# EAGLE design Smoothie Stamp Carrier A3 (EAGLE 6.4)

## Sheet 1 of 4: Brain Breakout
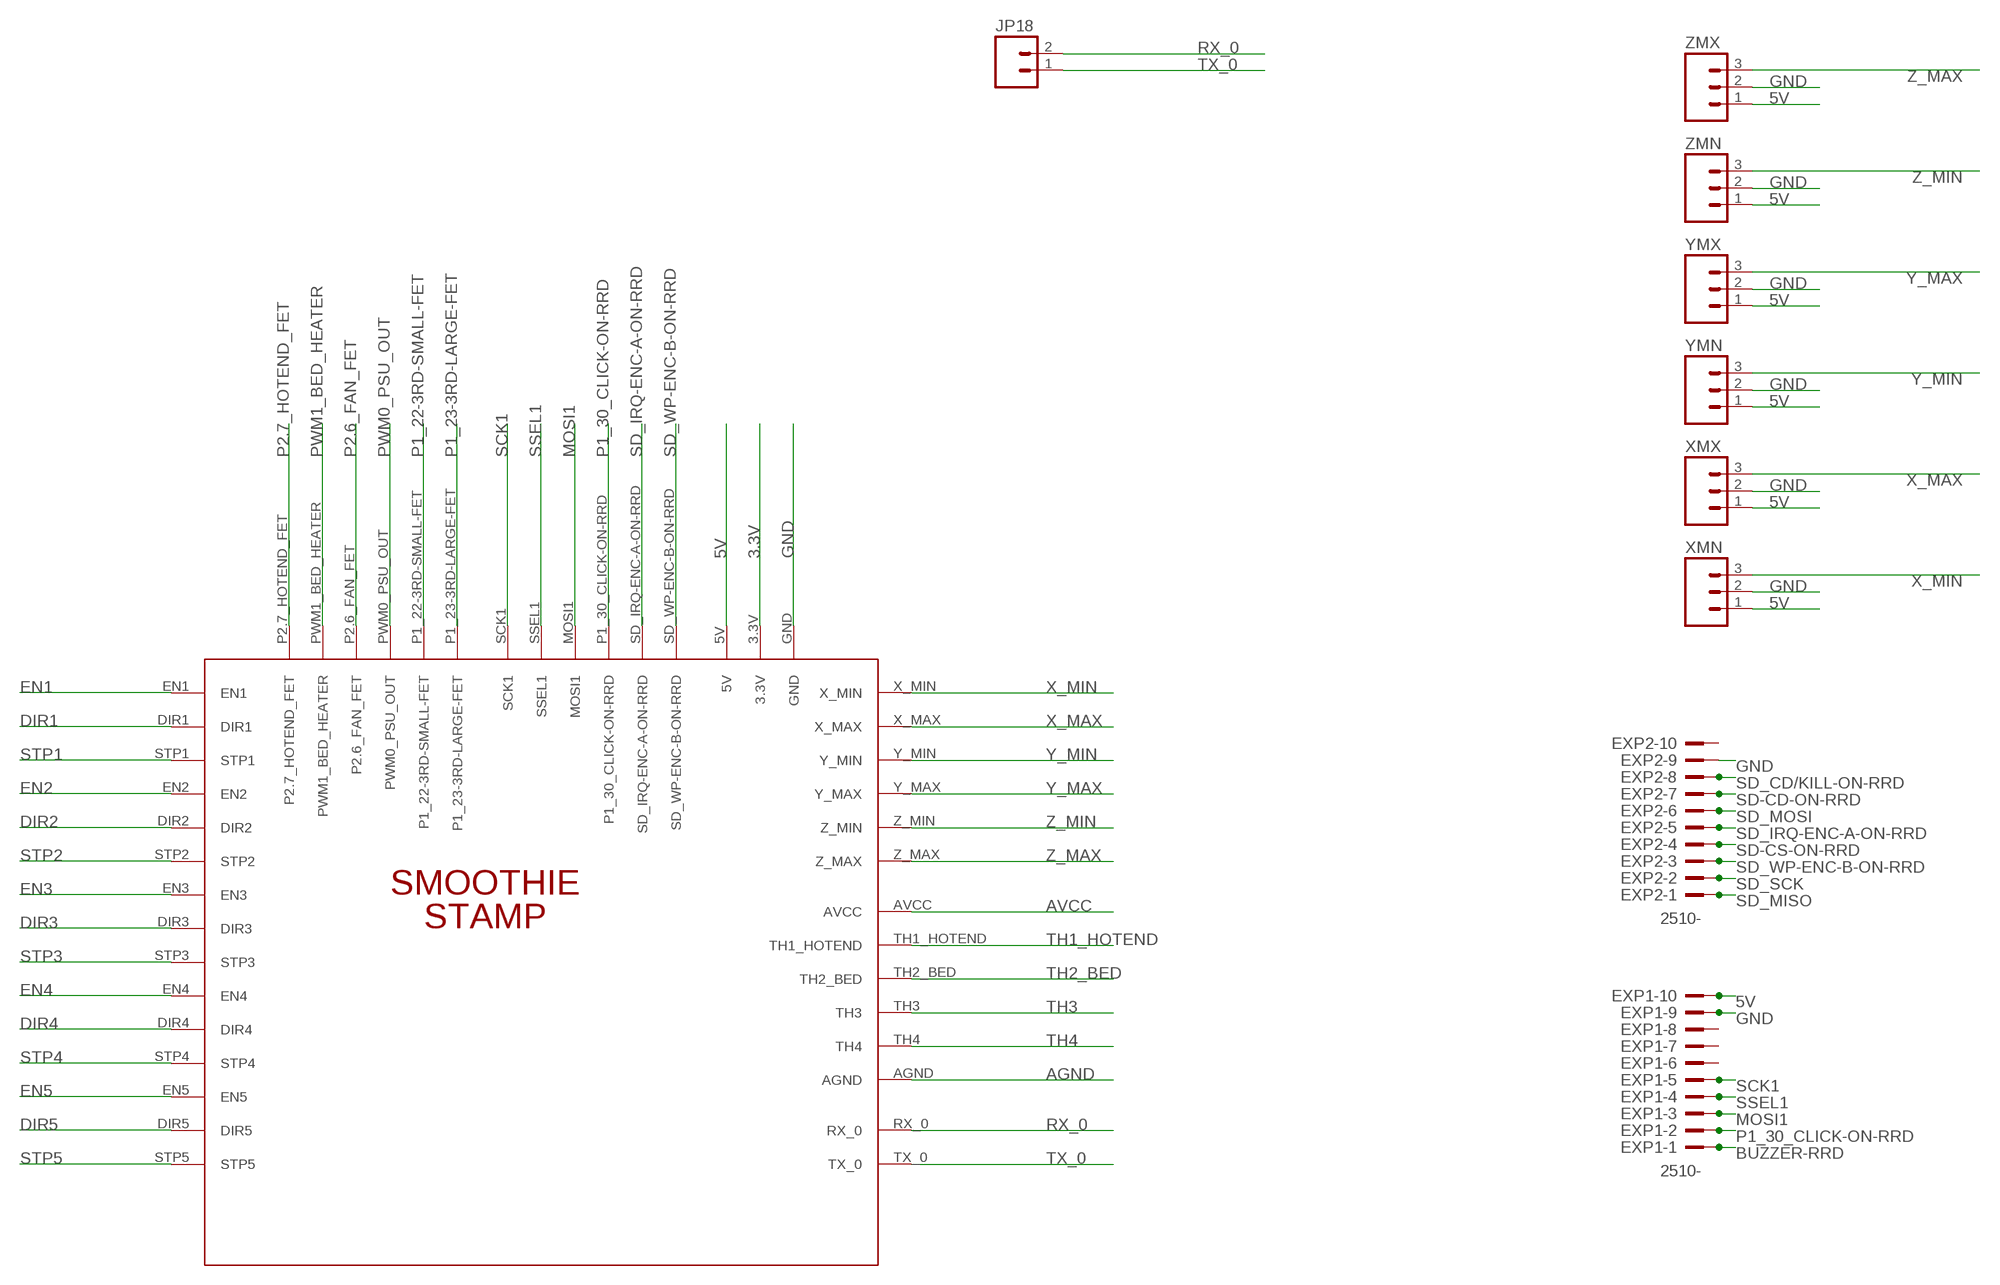
[diagram p0: schematic, sheet 1]

### Parts
EXP1  2510-  [PAK100/2500-10]
EXP2  2510-  [PAK100/2500-10]
JP18  M02LOCK  [1X02_LOCK]
U$1  SMOOTHIE-STAMPSMOOTHIE-STAMP-PTH  [SMOOTHIE-STAMP-PTH]
XMN  M03LOCK  [1X03_LOCK]
XMX  M03LOCK  [1X03_LOCK]
YMN  M03LOCK  [1X03_LOCK]
YMX  M03LOCK  [1X03_LOCK]
ZMN  M03LOCK  [1X03_LOCK]
ZMX  M03LOCK  [1X03_LOCK]

### Nets
3.3V: U$1.3.3V ; also sheet 2
5V: EXP1.10 U$1.5V XMN.1 XMX.1 YMN.1 YMX.1 ZMN.1 ZMX.1 ; also sheet 3
AGND: U$1.AGND ; also sheet 3
AVCC: U$1.AVCC ; also sheet 3
BUZZER-RRD: EXP1.1
DIR1 [Larger-Signals]: U$1.DIR1 ; also sheet 2
DIR2 [Larger-Signals]: U$1.DIR2 ; also sheet 2
DIR3 [Larger-Signals]: U$1.DIR3 ; also sheet 2
DIR4 [Larger-Signals]: U$1.DIR4 ; also sheet 2
DIR5 [Larger-Signals]: U$1.DIR5 ; also sheet 2
EN1 [Larger-Signals]: U$1.EN1 ; also sheet 2
EN2 [Larger-Signals]: U$1.EN2 ; also sheet 2
EN3 [Larger-Signals]: U$1.EN3 ; also sheet 2
EN4 [Larger-Signals]: U$1.EN4 ; also sheet 2
EN5 [Larger-Signals]: U$1.EN5 ; also sheet 2
GND: EXP1.9 EXP2.9 U$1.GND XMN.2 XMX.2 YMN.2 YMX.2 ZMN.2 ZMX.2 ; also sheet 2,3,4
MOSI1: EXP1.3 U$1.MOSI1
P1_22-3RD-SMALL-FET [Larger-Signals]: U$1.P1_22-3RD-SMALL-FET ; also sheet 3
P1_23-3RD-LARGE-FET [Larger-Signals]: U$1.P1_23-3RD-LARGE-FET ; also sheet 3
P1_30_CLICK-ON-RRD: EXP1.2 U$1.P1_30_CLICK-ON-RRD
P2.6_FAN_FET [Larger-Signals]: U$1.P2.6_FAN_FET ; also sheet 3
P2.7_HOTEND_FET [Larger-Signals]: U$1.P2.7_HOTEND_FET ; also sheet 3
PWM0_PSU_OUT [Larger-Signals]: U$1.PWM0_PSU_OUT ; also sheet 3
PWM1_BED_HEATER [Larger-Signals]: U$1.PWM1_BED_HEATER ; also sheet 3
RX_0: JP18.2 U$1.RX_0
SCK1: EXP1.5 U$1.SCK1
SD-CD-ON-RRD: EXP2.7
SD-CS-ON-RRD: EXP2.4
SD_CD/KILL-ON-RRD: EXP2.8
SD_IRQ-ENC-A-ON-RRD: EXP2.5 U$1.SD_IRQ-ENC-A-ON-RRD
SD_MISO: EXP2.1
SD_MOSI: EXP2.6
SD_SCK: EXP2.2
SD_WP-ENC-B-ON-RRD: EXP2.3 U$1.SD_WP-ENC-B-ON-RRD
SSEL1: EXP1.4 U$1.SSEL1
STP1 [Larger-Signals]: U$1.STP1 ; also sheet 2
STP2 [Larger-Signals]: U$1.STP2 ; also sheet 2
STP3 [Larger-Signals]: U$1.STP3 ; also sheet 2
STP4 [Larger-Signals]: U$1.STP4 ; also sheet 2
STP5 [Larger-Signals]: U$1.STP5 ; also sheet 2
TH1_HOTEND: U$1.TH1_HOTEND ; also sheet 3
TH2_BED: U$1.TH2_BED ; also sheet 3
TH3: U$1.TH3 ; also sheet 3
TH4: U$1.TH4 ; also sheet 3
TX_0: JP18.1 U$1.TX_0
X_MAX: U$1.X_MAX XMX.3
X_MIN: U$1.X_MIN XMN.3
Y_MAX: U$1.Y_MAX YMX.3
Y_MIN: U$1.Y_MIN YMN.3
Z_MAX: U$1.Z_MAX ZMX.3
Z_MIN: U$1.Z_MIN ZMN.3
Unconnected: EXP1.6 EXP1.7 EXP1.8 EXP2.10

## Sheet 2 of 4: Stepper Drivers
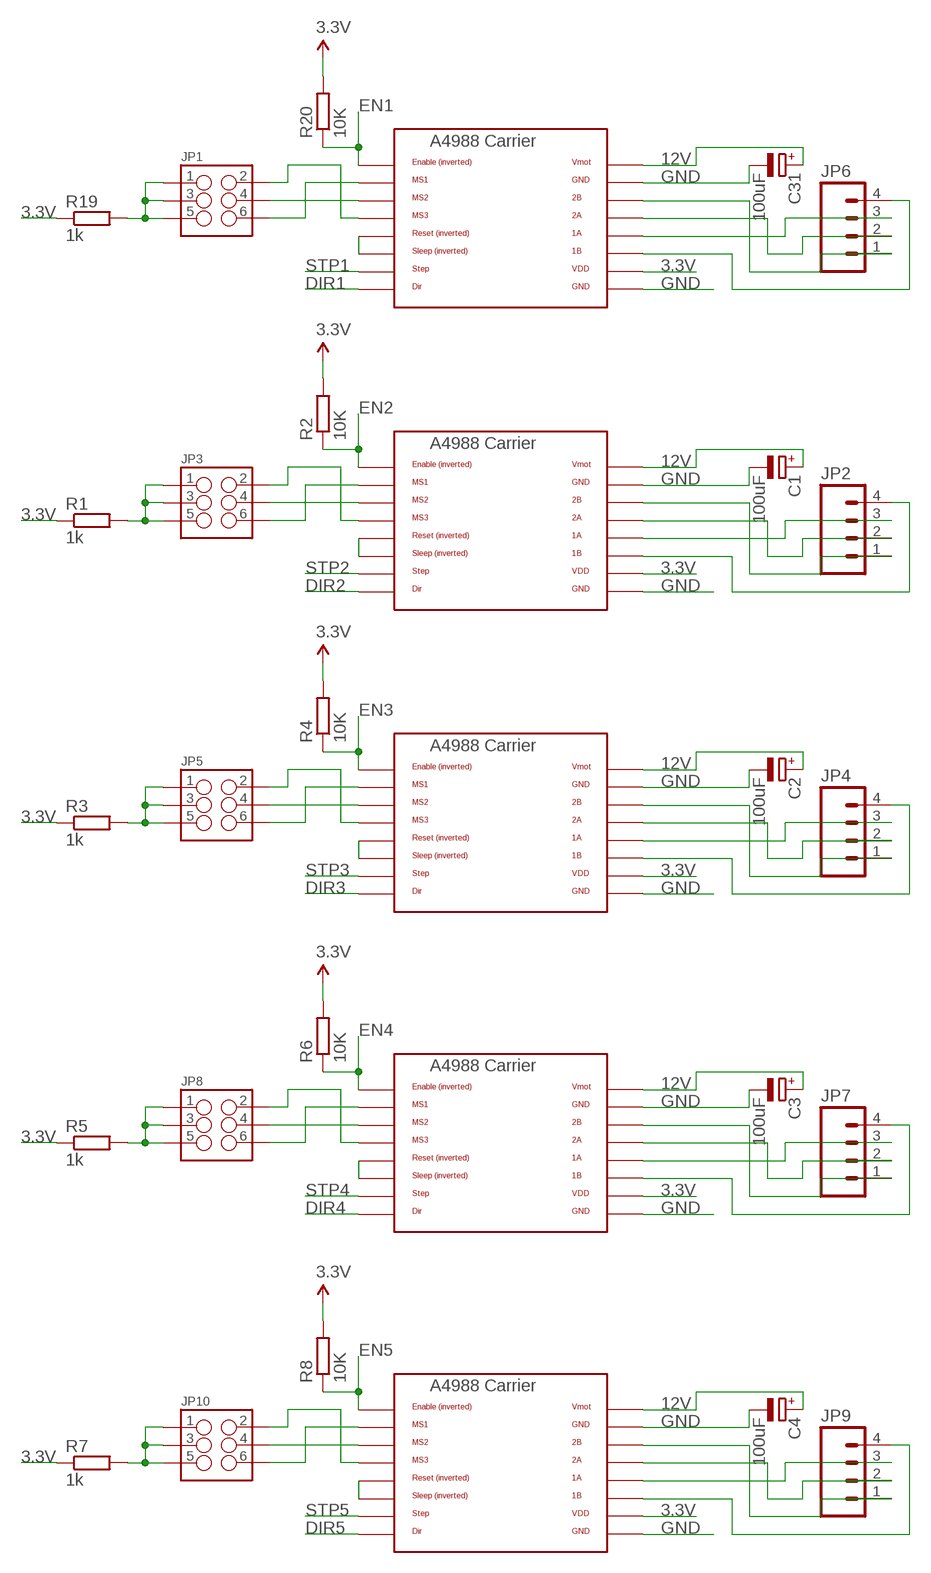
[diagram p1: schematic, sheet 2]

### Parts
C1  100uF  CPOL-EUE3.5-8  [E3,5-8]
C2  100uF  CPOL-EUE3.5-8  [E3,5-8]
C3  100uF  CPOL-EUE3.5-8  [E3,5-8]
C4  100uF  CPOL-EUE3.5-8  [E3,5-8]
C31  100uF  CPOL-EUE3.5-8  [E3,5-8]
JP1  M03X22X3_SILK_MALE_PTH  [2X3]
JP2  M04POLAR_LOCK  [MOLEX-1X4_LOCK]
JP3  M03X22X3_SILK_MALE_PTH  [2X3]
JP4  M04POLAR_LOCK  [MOLEX-1X4_LOCK]
JP5  M03X22X3_SILK_MALE_PTH  [2X3]
JP6  M04POLAR_LOCK  [MOLEX-1X4_LOCK]
JP7  M04POLAR_LOCK  [MOLEX-1X4_LOCK]
JP8  M03X22X3_SILK_MALE_PTH  [2X3]
JP9  M04POLAR_LOCK  [MOLEX-1X4_LOCK]
JP10  M03X22X3_SILK_MALE_PTH  [2X3]
R1  1k  R-EU_0204/2V  [0204V]
R2  10K  R-EU_0204/2V  [0204V]
R3  1k  R-EU_0204/2V  [0204V]
R4  10K  R-EU_0204/2V  [0204V]
R5  1k  R-EU_0204/2V  [0204V]
R6  10K  R-EU_0204/2V  [0204V]
R7  1k  R-EU_0204/2V  [0204V]
R8  10K  R-EU_0204/2V  [0204V]
R19  1k  R-EU_0204/2V  [0204V]
R20  10K  R-EU_0204/2V  [0204V]
U$2  POLOLU_A4983CARRIER  [A4988BREAKOUT]
U$3  POLOLU_A4983CARRIER  [A4988BREAKOUT]
U$4  POLOLU_A4983CARRIER  [A4988BREAKOUT]
U$5  POLOLU_A4983CARRIER  [A4988BREAKOUT]
U$6  POLOLU_A4983CARRIER  [A4988BREAKOUT]

### Nets
3.3V: R1.1 R2.2 R3.1 R4.2 R5.1 R6.2 R7.1 R8.2 R19.1 R20.2 U$2.VDD U$3.VDD U$4.VDD U$5.VDD U$6.VDD ; also sheet 1
12V: C1.+ C2.+ C3.+ C4.+ C31.+ U$2.VMOT U$3.VMOT U$4.VMOT U$5.VMOT U$6.VMOT ; also sheet 3,4
DIR1 [Larger-Signals]: U$2.DIR ; also sheet 1
DIR2 [Larger-Signals]: U$3.DIR ; also sheet 1
DIR3 [Larger-Signals]: U$4.DIR ; also sheet 1
DIR4 [Larger-Signals]: U$5.DIR ; also sheet 1
DIR5 [Larger-Signals]: U$6.DIR ; also sheet 1
EN1 [Larger-Signals]: R20.1 U$2.EN ; also sheet 1
EN2 [Larger-Signals]: R2.1 U$3.EN ; also sheet 1
EN3 [Larger-Signals]: R4.1 U$4.EN ; also sheet 1
EN4 [Larger-Signals]: R6.1 U$5.EN ; also sheet 1
EN5 [Larger-Signals]: R8.1 U$6.EN ; also sheet 1
GND: C1.- C2.- C3.- C4.- C31.- U$2.GND U$2.GND@0(GND) U$3.GND U$3.GND@0(GND) U$4.GND U$4.GND@0(GND) U$5.GND U$5.GND@0(GND) U$6.GND U$6.GND@0(GND) ; also sheet 1,3,4
N$1: JP1.6 U$2.MS1
N$2: JP1.2 U$2.MS3
N$3: JP1.4 U$2.MS2
N$4: JP1.1 JP1.3 JP1.5 R19.2
N$5: JP6.4 U$2.1B
N$6: JP6.3 U$2.1A
N$7: JP6.2 U$2.2A
N$8: JP6.1 U$2.2B
N$9: U$3.RST U$3.SLP(SLEEP)
N$10: JP3.1 JP3.3 JP3.5 R1.2
N$11: JP3.6 U$3.MS1
N$12: JP3.2 U$3.MS3
N$13: JP3.4 U$3.MS2
N$14: JP2.4 U$3.1B
N$15: JP2.3 U$3.1A
N$16: JP2.2 U$3.2A
N$17: JP2.1 U$3.2B
N$18: U$4.RST U$4.SLP(SLEEP)
N$19: JP5.1 JP5.3 JP5.5 R3.2
N$20: JP5.6 U$4.MS1
N$21: JP5.2 U$4.MS3
N$22: JP5.4 U$4.MS2
N$23: JP4.4 U$4.1B
N$24: JP4.3 U$4.1A
N$25: JP4.2 U$4.2A
N$26: JP4.1 U$4.2B
N$27: U$5.RST U$5.SLP(SLEEP)
N$28: JP8.1 JP8.3 JP8.5 R5.2
N$29: JP8.6 U$5.MS1
N$30: JP8.2 U$5.MS3
N$31: JP8.4 U$5.MS2
N$32: JP7.4 U$5.1B
N$33: JP7.3 U$5.1A
N$34: JP7.2 U$5.2A
N$35: U$2.RST U$2.SLP(SLEEP)
N$36: JP7.1 U$5.2B
N$37: U$6.RST U$6.SLP(SLEEP)
N$38: JP10.1 JP10.3 JP10.5 R7.2
N$39: JP10.6 U$6.MS1
N$40: JP10.2 U$6.MS3
N$41: JP10.4 U$6.MS2
N$42: JP9.4 U$6.1B
N$43: JP9.3 U$6.1A
N$44: JP9.2 U$6.2A
N$45: JP9.1 U$6.2B
STP1 [Larger-Signals]: U$2.STEP ; also sheet 1
STP2 [Larger-Signals]: U$3.STEP ; also sheet 1
STP3 [Larger-Signals]: U$4.STEP ; also sheet 1
STP4 [Larger-Signals]: U$5.STEP ; also sheet 1
STP5 [Larger-Signals]: U$6.STEP ; also sheet 1

## Sheet 3 of 4: Heaters & Fans
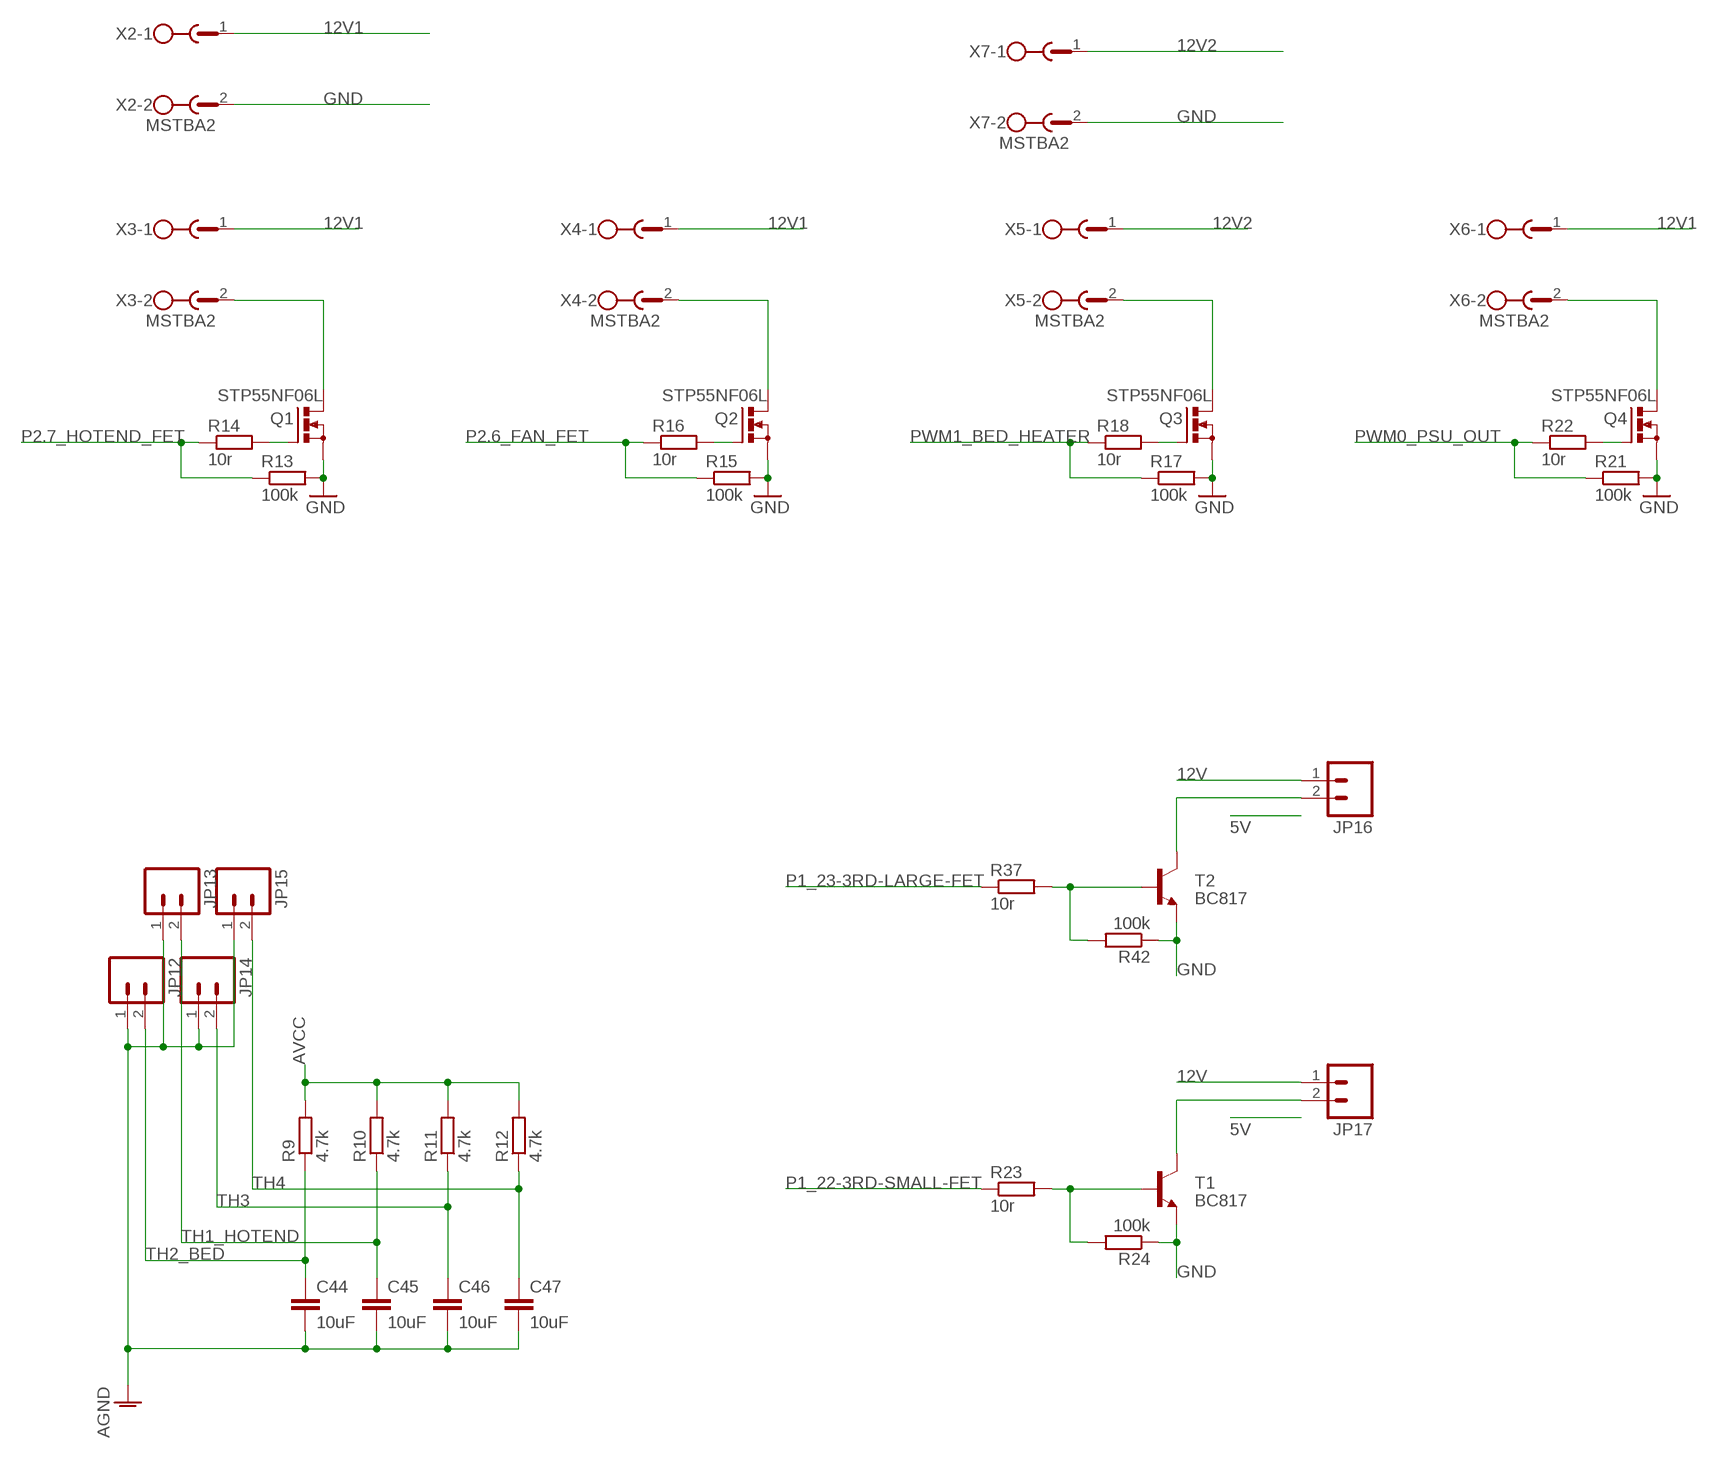
[diagram p2: schematic, sheet 3]

### Parts
C44  10uF  C-EU050-025X075  [C050-025X075]
C45  10uF  C-EU050-025X075  [C050-025X075]
C46  10uF  C-EU050-025X075  [C050-025X075]
C47  10uF  C-EU050-025X075  [C050-025X075]
JP12  M02PTH  [1X02]
JP13  M02PTH  [1X02]
JP14  M02PTH  [1X02]
JP15  M02PTH  [1X02]
JP16  M02LOCK  [1X02_LOCK]
JP17  M02LOCK  [1X02_LOCK]
Q1  STP55NF06L  IRF512  [TO220BV]
Q2  STP55NF06L  IRF512  [TO220BV]
Q3  STP55NF06L  IRF512  [TO220BV]
Q4  STP55NF06L  IRF512  [TO220BV]
R9  4.7k  R-EU_0207/5V  [0207/5V]
R10  4.7k  R-EU_0207/5V  [0207/5V]
R11  4.7k  R-EU_0207/5V  [0207/5V]
R12  4.7k  R-EU_0207/5V  [0207/5V]
R13  100k  R-EU_0204/2V  [0204V]
R14  10r  R-EU_0204/2V  [0204V]
R15  100k  R-EU_0204/2V  [0204V]
R16  10r  R-EU_0204/2V  [0204V]
R17  100k  R-EU_0204/2V  [0204V]
R18  10r  R-EU_0204/2V  [0204V]
R21  100k  R-EU_0204/2V  [0204V]
R22  10r  R-EU_0204/2V  [0204V]
R23  10r  R-EU_0204/2V  [0204V]
R24  100k  R-EU_0204/2V  [0204V]
R37  10r  R-EU_0204/2V  [0204V]
R42  100k  R-EU_0204/2V  [0204V]
T1  BC817  TRANSISTOR_NPN2N3904  [TO-92]
T2  BC817  TRANSISTOR_NPN2N3904  [TO-92]
X2  MSTBA2  [MSTBA2]
X3  MSTBA2  [MSTBA2]
X4  MSTBA2  [MSTBA2]
X5  MSTBA2  [MSTBA2]
X6  MSTBA2  [MSTBA2]
X7  MSTBA2  [MSTBA2]

### Nets
12V: JP16.1 JP17.1 ; also sheet 2,4
12V1: X2.1 X3.1 X4.1 X6.1
12V2: X5.1 X7.1
AGND: C44.2 C45.2 C46.2 C47.2 JP12.1 JP13.1 JP14.1 JP15.1 ; also sheet 1
AVCC: R9.2 R10.2 R11.2 R12.2 ; also sheet 1
GND: Q1.S Q2.S Q3.S Q4.S R13.2 R15.2 R17.2 R21.2 R24.1 R42.1 T1.1(E) T2.1(E) X2.2 X7.2 ; also sheet 1,2,4
N$46: Q1.D X3.2
N$47: Q2.G R16.2
N$48: Q2.D X4.2
N$49: Q3.G R18.2
N$50: Q3.D X5.2
N$51: Q4.G R22.2
N$58: Q4.D X6.2
N$59: Q1.G R14.2
N$60: JP16.2 T2.3(C)
N$61: R37.2 R42.2 T2.2(B)
N$62: JP17.2 T1.3(C)
N$63: R23.2 R24.2 T1.2(B)
P1_22-3RD-SMALL-FET [Larger-Signals]: R23.1 ; also sheet 1
P1_23-3RD-LARGE-FET [Larger-Signals]: R37.1 ; also sheet 1
P2.6_FAN_FET [Larger-Signals]: R15.1 R16.1 ; also sheet 1
P2.7_HOTEND_FET [Larger-Signals]: R13.1 R14.1 ; also sheet 1
PWM0_PSU_OUT [Larger-Signals]: R21.1 R22.1 ; also sheet 1
PWM1_BED_HEATER [Larger-Signals]: R17.1 R18.1 ; also sheet 1
TH1_HOTEND: C45.1 JP13.2 R10.1 ; also sheet 1
TH2_BED: C44.1 JP12.2 R9.1 ; also sheet 1
TH3: C46.1 JP14.2 R11.1 ; also sheet 1
TH4: C47.1 JP15.2 R12.1 ; also sheet 1

## Sheet 4 of 4: Power & Connectors
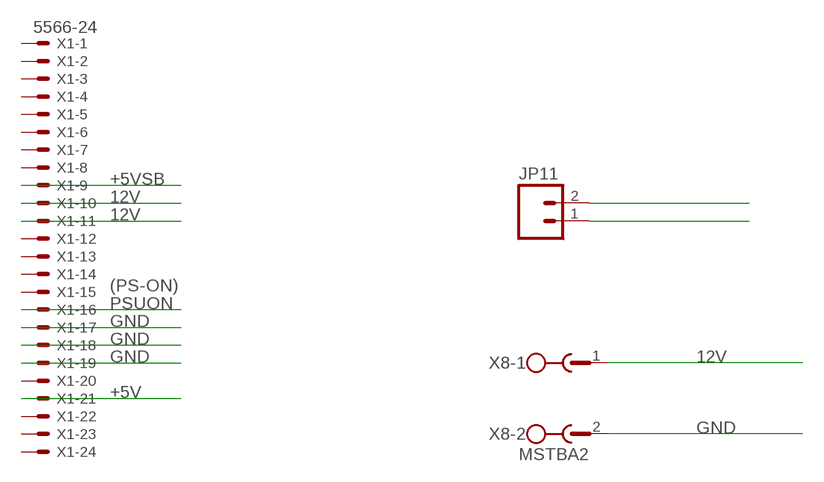
[diagram p3: schematic, sheet 4]

### Parts
JP11  M02LOCK  [1X02_LOCK]
X1  5566-24  [5566-24]
X8  MSTBA2  [MSTBA2]

### Nets
12V: X1.10 X1.11 X8.1 ; also sheet 2,3
+5V: X1.21
+5VSB [1-Amp Class]: X1.9
GND: JP11.1 X1.17 X1.18 X1.19 X8.2 ; also sheet 1,2,3
PSUON: JP11.2 X1.16
Unconnected: X1.1 X1.2 X1.3 X1.4 X1.5 X1.6 X1.7 X1.8 X1.12 X1.13 X1.14 X1.15 X1.20 X1.22 X1.23 X1.24

### Notes on the sheet
- (PS-ON)

## Library data of the parts
C1-C4 C31 = rcl:CPOL-EU: POLARIZED CAPACITOR, European symbol
C44-C47 = rcl:C-EU: CAPACITOR, European symbol
EXP1 EXP2 = con-3m:2510-: 3M (TM) Pak 100 4-Wall Header Source: 3M; MF: 3M; MPN: 2510-6002UB; OC_FARNELL: 9838244; OC_NEWARK: 46F4725
JP1 JP3 JP5 JP8 JP10 = SparkFun-Connectors:M03X2: 2x3 .1" header. Shrouded, with keying- CONN-10681 SMT- CONN-11415 Pogo pins- HW-11044; PROD_ID: CONN-09701
JP2 JP4 JP6 JP7 JP9 = SparkFun-Connectors:M04: Header 4 Standard 4-pin 0.1" header. Use with straight break away headers (SKU : PRT-00116), right angle break away headers (PRT-00553), swiss pins (PRT-00743), machine pins (PRT-00117), and female headers (PRT-00115). Molex polarized connector foot print use with SKU : PRT-08231 with associated crimp pins and housings. 1MM SMD Version SKU: PRT-10208
JP11-JP18 = SparkFun-Connectors:M02: Standard 2-pin 0.1" header. Use with - straight break away headers ( PRT-00116) - right angle break away headers (PRT-00553) - swiss pins (PRT-00743) - machine pins (PRT-00117) - female headers (PRT-00115) Molex polarized connector foot print use with: PRT-08233 with associated crimp pins and housings. 2.54_SCREWTERM for use with PRT-10571. 3.5mm Screw Terminal footprints for PRT-08084 5mm Screw Terminal footprints for use with PRT-08432
Q1-Q4 = transistor-power:IRF512: N-CHANNEL MOS FET
R1-R24 R37 R42 = rcl:R-EU_: RESISTOR, European symbol
T1 T2 = SparkFun-DiscreteSemi:TRANSISTOR_NPN: Generic NPN BJT MMBT2222A - TRANS-08049 (SOT-23, 1A 40V) MPSA42 - TRANS-09116 (SOT-23, 500mA 300V) MMBT5088LT1G - TRANS-11160 (SOT-23, 50 mA 30V) BC547 - COM-08928 <http://www.sparkfun.com/products/8928> (TO-92 45V 100mA) (1.Collector 2.Base 3.Emitter) 2N3904 - COM-00521 <http://www.sparkfun.com/products/521> (TO-92 40V 200mA) (1.Emitter 2.Base 3.Collector) P2N2222A - COM-12852 <http://www.sparkfun.com/products/12852> (TO-92 40V 600mA) (1.Collector 2.Base 3.Emitter); PROD_ID: TRANS-08447
U$1 = Micro-Smoothie-Brain:SMOOTHIE-STAMP
U$2-U$6 = RepRapjr:POLOLU_A4983CARRIER
X1 = con-molex:5566-24: Mini FIT connector 24 pol Source: http://www.molex.com; OC_FARNELL: unknown; OC_NEWARK: unknown
X2-X8 = con-phoenix-508:MSTBA2: PHOENIX; MF: FARNELL; MPN: 1757242; OC_FARNELL: 3705171; OC_NEWARK: 71C4161
XMN XMX YMN YMX ZMN ZMX = SparkFun-Connectors:M03: Header 3 Standard 3-pin 0.1" header. Use with straight break away headers (SKU : PRT-00116), right angle break away headers (PRT-00553), swiss pins (PRT-00743), machine pins (PRT-00117), and female headers (PRT-00115). Molex polarized connector foot print use with SKU : PRT-08232 with associated crimp pins and housings.

## Net classes
1 Larger-Signals: width 0.508 mm, clearance 0.508 mm
2 ground: width 0.254 mm
3 1-Amp Class: width 0.406 mm
4 30-Amp Class: width 2.54 mm

## Board
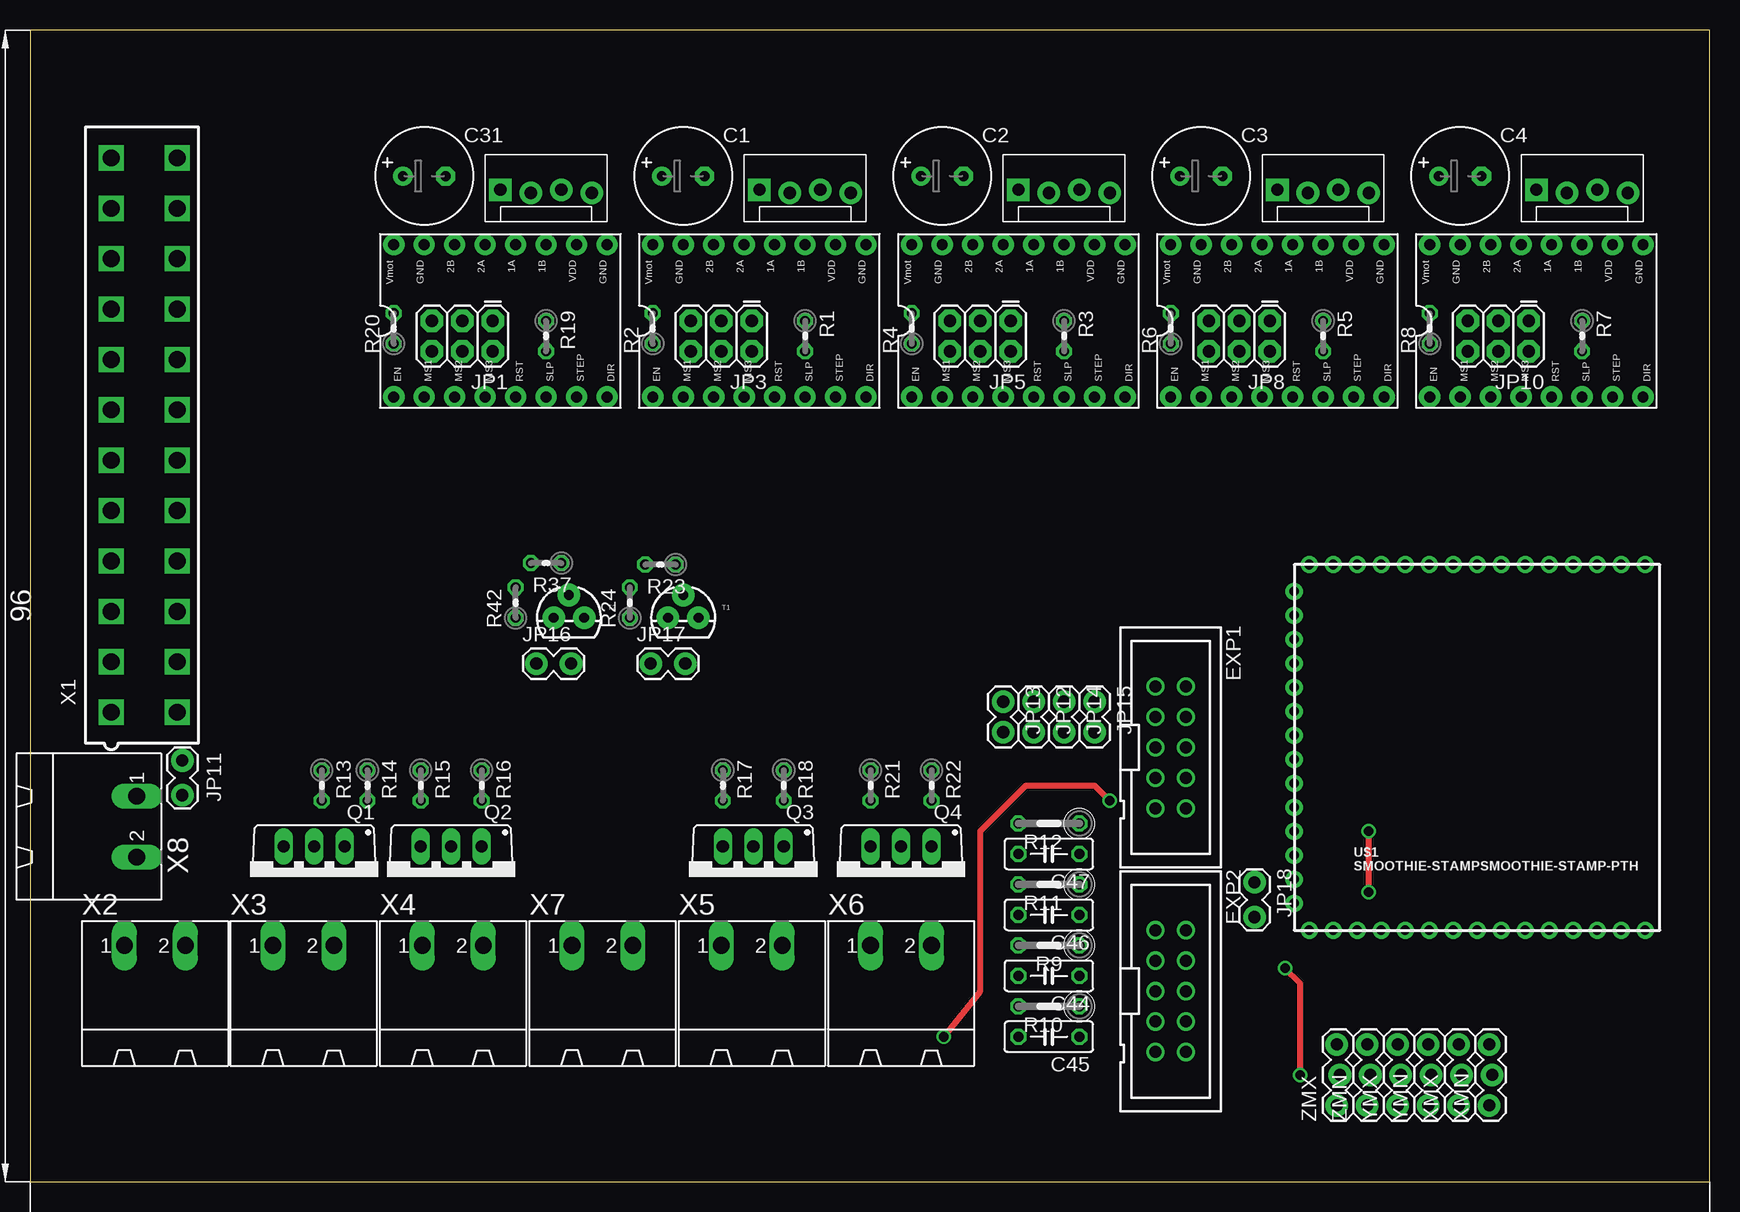
[diagram p4: board, top side]
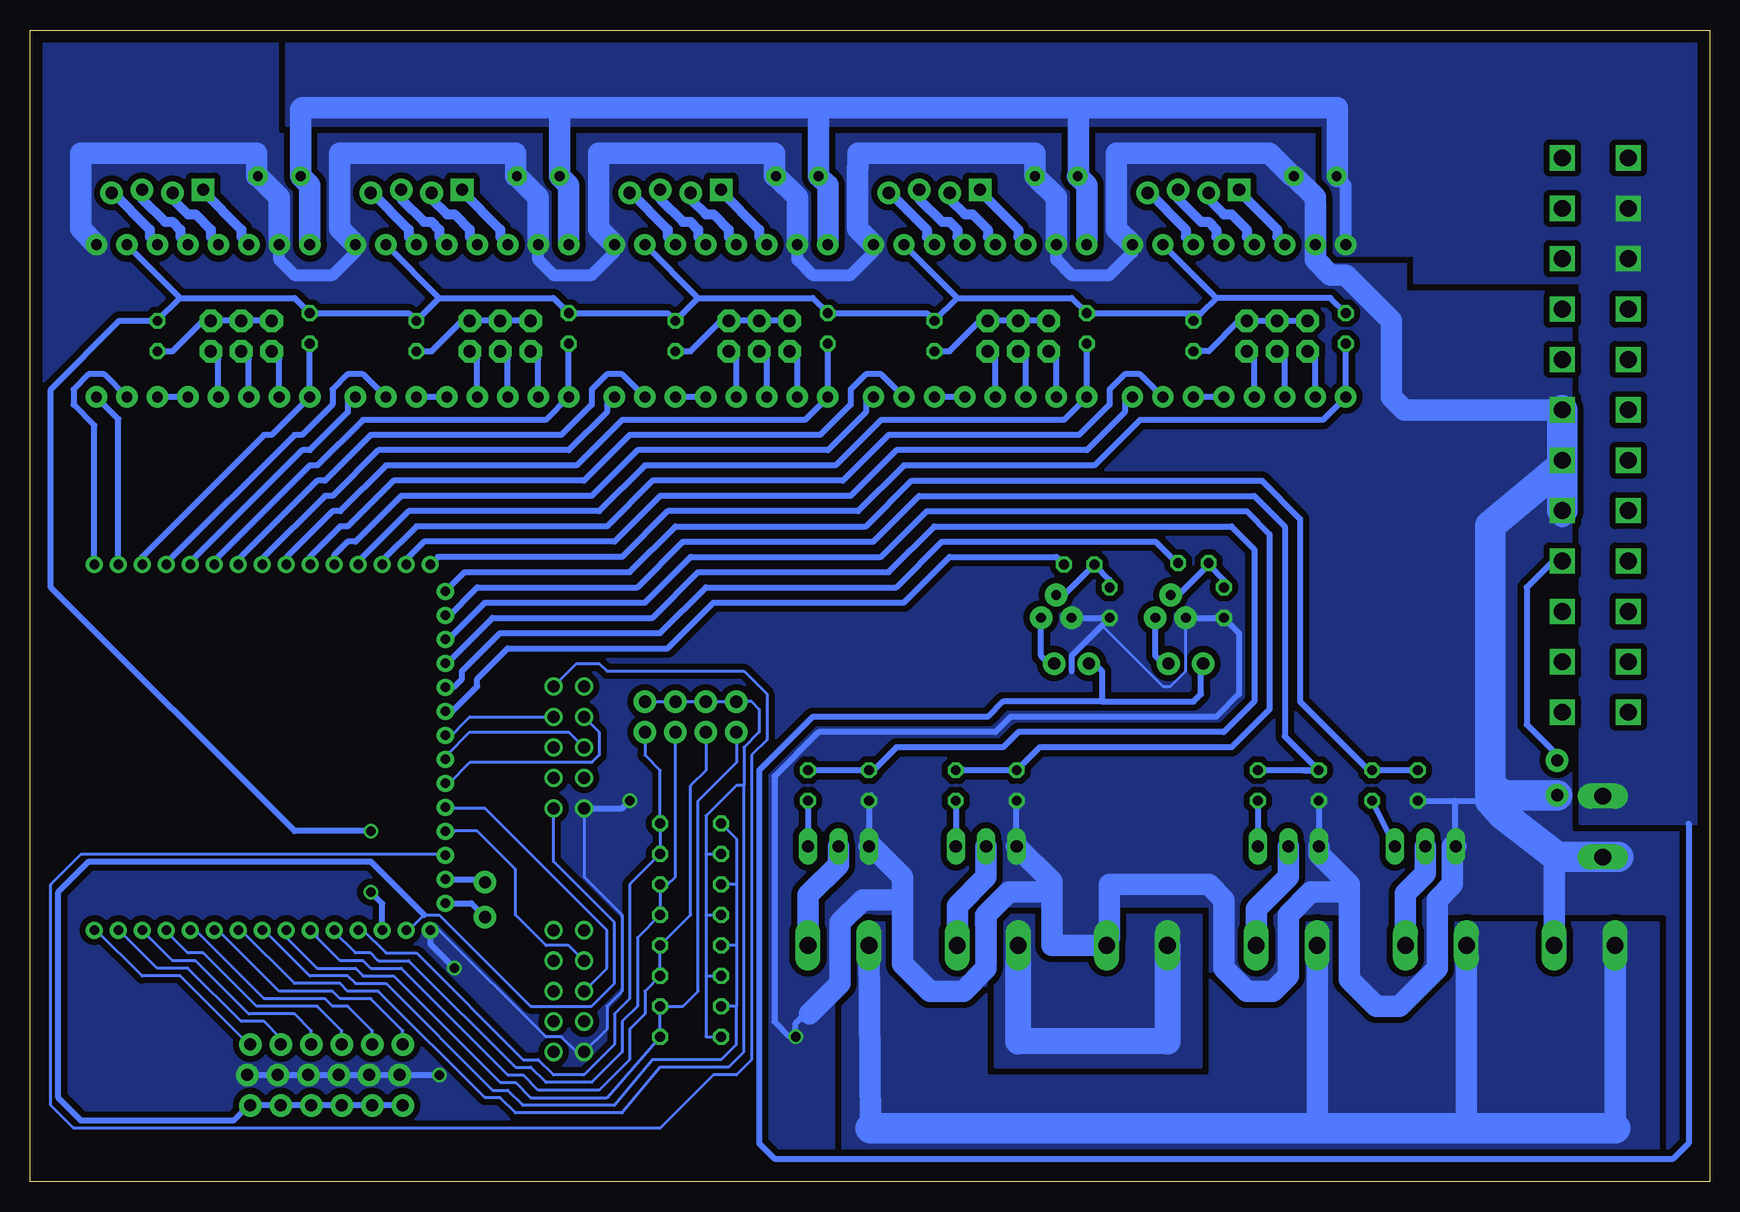
[diagram p5: board, bottom side, seen from below]

Size 140 x 96 mm. Coordinates in mm from the lower left corner, seen from the top.
Outline: 0,0 140,0 140,96 0,96 0,0
Copper layers (1*16): Top 0.035mm / dielectric 1.5mm / Bottom 0.035mm
Design rules "Ray CNC *": minimum track width 10mil, minimum drill 24mil, track to track 10mil, track to pad 10mil, pad to pad 10mil, via to via 10mil, smd to smd 0mil, copper to edge 40mil, drill to drill 8mil, minimum pad ring 10mil, minimum via ring 8mil, stop-mask expansion 4mil, vias tented up to drill 0mil, thermal gap 10mil

### Footprints (pad centres in the part's own frame; a part is rotated, then mirrored left to right if it is on the bottom)
E3,5-8 = drill 0.813 pad 1.6: + -1.778,0 | drill 0.813 pad 1.6 octagon: - 1.778,0
C050-025X075 = drill 0.813 octagon: 1 -2.54,0; 2 2.54,0
PAK100/2500-10 = drill 1 pad 1.422: 1 -5.08,-1.27; 2 -5.08,1.27; 3 -2.54,-1.27; 4 -2.54,1.27; 5 0,-1.27; 6 0,1.27; 7 2.54,-1.27; 8 2.54,1.27; 9 5.08,-1.27; 10 5.08,1.27
2X3 = drill 1.016 pad 1.88 octagon: 1 0,0; 2 0,2.54; 3 2.54,0; 4 2.54,2.54; 5 5.08,0; 6 5.08,2.54
MOLEX-1X4_LOCK = drill 1.016 pad 1.88 square: 1 0,0.127 | drill 1.016 pad 1.88: 2 2.54,-0.127; 3 5.08,0.127; 4 7.62,-0.127
1X02_LOCK = drill 1.016 pad 1.88: 1 -0.178,0; 2 2.718,0
1X02 = drill 1.016 pad 1.88: 1 0,0; 2 2.54,0
TO220BV = drill 1.016 long: D 0,-2.54; G -2.54,-2.54; S 2.54,-2.54
0204V = drill 0.813 octagon: 1 -1.27,0; 2 1.27,0
0207/5V = drill 0.813 octagon: 1 -2.54,0; 2 2.54,0
TO-92 = drill 0.813 pad 1.88: 1 -1.27,0; 2 0,1.905; 3 1.27,0
SMOOTHIE-STAMP-PTH = drill 0.8 pad 1.422: 3.3V 5.381,0; 5V 3.381,0; AGND 17.381,0; AVCC 15.381,0; DIR1 3.381,30.48; DIR2 9.381,30.48; DIR3 15.381,30.48; DIR4 21.381,30.48; DIR5 27.381,30.48; EN1 1.381,30.48; EN2 7.381,30.48; EN3 13.381,30.48; EN4 19.381,30.48; EN5 25.381,30.48; GND 1.381,0; MOSI1 0.127,12.238; P1_22-3RD-SMALL-FET 0.127,18.238; P1_23-3RD-LARGE-FET 0.127,20.238; P1_30_CLICK-ON-RRD 0.127,6.238; P2.6_FAN_FET 0.127,26.238; P2.7_HOTEND_FET 0.127,28.238; PWM0_PSU_OUT 0.127,22.238; PWM1_BED_HEATER 0.127,24.238; RX_0 0.127,2.238; SCK1 0.127,14.238; SD_IRQ-ENC-A-ON-RRD 0.127,10.238; SD_WP-ENC-B-ON-RRD 0.127,8.238; SSEL1 0.127,16.238; STP1 5.381,30.48; STP2 11.381,30.48; STP3 17.381,30.48; STP4 23.381,30.48; STP5 29.381,30.48; TH1_HOTEND 13.381,0; TH2_BED 11.381,0; TH3 9.381,0; TH4 7.381,0; TX_0 0.127,4.238; X_MAX 27.381,0; X_MIN 29.381,0; Y_MAX 23.381,0; Y_MIN 25.381,0; Z_MAX 19.381,0; Z_MIN 21.381,0
A4988BREAKOUT = drill 0.9 pad 1.778: 1A 8.89,1.27; 1B 11.43,1.27; 2A 6.35,1.27; 2B 3.81,1.27; DIR 16.51,-11.43; EN -1.27,-11.43; GND 16.51,1.27; GND@0 1.27,1.27; MS1 1.27,-11.43; MS2 3.81,-11.43; MS3 6.35,-11.43; RST 8.89,-11.43; SLP 11.43,-11.43; STEP 13.97,-11.43; VDD 13.97,1.27; VMOT -1.27,1.27
5566-24 = drill 1.4 square: 1 23.1,-2.75; 2 18.9,-2.75; 3 14.7,-2.75; 4 10.5,-2.75; 5 6.3,-2.75; 6 2.1,-2.75; 7 -2.1,-2.75; 8 -6.3,-2.75; 9 -10.5,-2.75; 10 -14.7,-2.75; 11 -18.9,-2.75; 12 -23.1,-2.75; 13 23.1,2.75; 14 18.9,2.75; 15 14.7,2.75; 16 10.5,2.75; 17 6.3,2.75; 18 2.1,2.75; 19 -2.1,2.75; 20 -6.3,2.75; 21 -10.5,2.75; 22 -14.7,2.75; 23 -18.9,2.75; 24 -23.1,2.75
MSTBA2 = drill 1.397 long: 1 -2.54,5.08; 2 2.54,5.08
1X03_LOCK = drill 1.016 pad 1.88: 1 0,0.127; 2 2.54,-0.127; 3 5.08,0.127

### Placement (x,y rotation side)
C1  54.45,83.82 0 top
C2  76.04,83.82 0 top
C3  97.63,83.82 0 top
C4  119.22,83.82 0 top
C31  32.86,83.82 0 top
C44  84.93,17.14 180 top
C45  84.93,12.06 180 top
C46  84.93,22.23 180 top
C47  84.93,27.3 180 top
EXP1  95.09,36.2 270 top
EXP2  95.09,15.88 270 top
JP1  38.58,71.75 180 top
JP2  60.8,82.55 0 top
JP3  60.16,71.75 180 top
JP4  82.39,82.55 0 top
JP5  81.75,71.75 180 top
JP6  39.21,82.55 0 top
JP7  103.98,82.55 0 top
JP8  103.34,71.75 180 top
JP9  125.57,82.55 0 top
JP10  124.94,71.75 180 top
JP11  12.7,32.38 90 top
JP12  83.66,40.01 270 top
JP13  81.12,40.01 270 top
JP14  86.2,40.01 270 top
JP15  88.74,40.01 270 top
JP16  42.38,43.18 0 top
JP17  51.91,43.18 0 top
JP18  102.08,24.77 270 top
Q1  23.69,25.4 180 top
Q2  35.11,25.4 180 top
Q3  60.29,25.4 180 top
Q4  72.61,25.4 180 top
R1  64.61,70.48 270 top
R2  51.91,71.12 90 top
R3  86.2,70.48 270 top
R4  73.5,71.12 90 top
R5  107.79,70.48 270 top
R6  95.09,71.12 90 top
R7  129.38,70.48 270 top
R8  116.68,71.12 90 top
R9  84.93,19.68 180 top
R10  84.93,14.61 180 top
R11  84.93,24.77 180 top
R12  84.93,29.84 180 top
R13  24.32,33.02 270 top
R14  28.13,33.02 270 top
R15  32.58,33.02 270 top
R16  37.66,33.02 270 top
R17  57.75,33.02 270 top
R18  62.83,33.02 270 top
R19  43.02,70.48 270 top
R20  30.32,71.12 90 top
R21  70.07,33.02 270 top
R22  75.15,33.02 270 top
R23  52.55,51.44 180 top
R24  50.01,48.26 90 top
R37  43.02,51.56 180 top
R42  40.48,48.26 90 top
T1  54.45,46.99 0 top
T2  44.92,46.99 0 top
U$1  105.25,20.95 0 top
U$2  31.59,76.83 0 top
U$3  53.18,76.83 0 top
U$4  74.77,76.83 0 top
U$5  96.36,76.83 0 top
U$6  117.95,76.83 0 top
X1  9.53,62.23 270 top
X2  10.41,14.61 0 top
X3  22.8,14.61 0 top
X4  35.24,14.61 0 top
X5  60.16,14.61 0 top
X6  72.61,14.61 0 top
X7  47.72,14.61 0 top
X8  3.81,29.59 270 top
XMN  121.76,6.35 90 top
XMX  119.22,6.35 90 top
YMN  116.68,6.35 90 top
YMX  114.14,6.35 90 top
ZMN  111.6,6.35 90 top
ZMX  109.06,6.35 90 top

### Tracks (layer width: path | path; a pad name or v marks a point on that pad's centre or on a via)
3.3V  (via drill 0.8)
  Top 0.508: v111.6,24.13 v111.6,29.21
  Bottom 0.508: 41.11,73.66 42.38,72.39 | 42.38,72.39 R19.1 43.66,72.39 | 41.11,73.66 31.59,73.66 R20.2 | 41.11,73.66 U$2.VDD | 43.66,72.39 R2.2 53.18,73.66 62.7,73.66 | 43.66,72.39 42.38,72.39 | 62.7,73.66 R1.1 65.25,72.39 R4.2 74.77,73.66 84.3,73.66 | U$3.VDD 62.7,73.66 | 84.3,73.66 R3.1 86.83,72.39 R6.2 96.36,73.66 105.89,73.66 | U$4.VDD 84.3,73.66 | 105.89,73.66 R5.1 108.42,72.39 R8.2 117.95,73.66 127.47,73.66 | U$5.VDD 105.89,73.66 | 127.47,73.66 R7.1 132.56,71.75 138.27,66.04 138.27,49.53 117.95,29.21 v111.6,29.21 | U$6.VDD 127.47,73.66 | U$1.3.3V 110.63,23.16 v111.6,24.13
5V
  Bottom 0.254: U$1.5V 108.42,20.95 107.16,22.23 105.89,22.23 98.27,14.61 93.19,14.61 91.28,16.51 91.28,21.59 96.36,26.67 EXP1.10
  Bottom 0.508: ZMX.1 ZMN.1 YMX.1 YMN.1 XMX.1 XMN.1 121.76,6.35 123.03,5.08 135.73,5.08 137.63,6.99 137.63,24.13 135.09,26.67 111.6,26.67 107.16,22.23
12V
  Bottom 0.508: JP17.1 51.27,43.18 50.64,42.55 50.64,40.01 | 50.64,40.01 58.9,40.01 60.16,38.73 74.77,38.73 79.22,34.29 79.22,3.17 77.94,1.91 3.01,1.91 1.74,3.17 1.74,29.84 | 50.64,40.01 43.02,40.01 42.38,40.64 42.38,43.18 JP16.1
  Bottom 1.016: U$2.VMOT 30.32,83.06 31.02,83.76 C31.+
  Bottom 1.778: U$3.VMOT 51.91,83.06 52.61,83.76 | 52.61,83.76 C1.+ | U$4.VMOT 73.5,83.06 C2.+ 74.26,89.41 74.14,89.53 | U$5.VMOT 95.09,83.06 C3.+ 95.85,89.41 95.72,89.53 | U$6.VMOT 116.68,83.06 C4.+ 117.44,89.41 117.31,89.53 95.72,89.53 | 95.72,89.53 74.14,89.53 | 74.14,89.53 52.61,89.53 | 52.61,89.53 52.61,83.76 | 52.61,89.53 31.02,89.53 31.02,83.76
  pour Bottom (isolate 0.508, no thermals): 24.61,74.93 10.79,74.93 10.79,29.84 0.63,29.84 0.63,89.53 32.23,89.53 32.23,77.22 24.61,77.22
  pour Bottom (no thermals): 0.63,88.01 118.58,88.01 118.58,95.63 0.63,95.63
12V1
  Bottom 1.778: X2.1 7.87,4.45 | 20.26,4.45 X3.1 | 32.7,4.45 X4.1 | 69.94,4.45 X6.1
  Bottom 2.54: 7.87,4.45 20.26,4.45 32.7,4.45 69.94,4.45
  pour Bottom (isolate 0.508, rank 2, no thermals): 4.29,21.59 4.29,2.54 72.23,2.54 72.23,21.59
12V2
  Bottom 2.184: X7.1 45.18,11.68 57.62,11.68 X5.1
  pour Bottom (isolate 0.508, no thermals): 59.53,22.23 42.38,22.23 42.38,9.53 59.53,9.53
AGND
  Bottom 0.254: JP15.1 JP14.1 JP12.1 JP13.1 79.85,40.01 79.22,39.37 79.22,37.47 80.48,36.2 80.48,33.02 | 83.66,27.3 C47.2 | 83.66,27.3 83.66,30.48 81.12,33.02 80.48,33.02 | 83.66,27.3 83.66,22.23 | 83.66,22.23 C46.2 | 83.66,22.23 83.66,17.14 | 83.66,17.14 C44.2 | 83.66,17.14 83.66,12.06 C45.2 | 80.48,33.02 80.48,10.79 81.75,9.53 87.47,9.53 90.64,5.71 99.53,5.71 100.81,6.99 102.08,6.99 110.97,15.88 113.5,15.88 114.14,16.51 117.95,16.51 122.39,20.95 U$1.AGND
AVCC
  Bottom 0.254: 81.12,24.77 R11.2 | 81.12,24.77 81.12,28.57 R12.2 | 81.12,24.77 81.12,19.68 | 81.12,19.68 R9.2 | 81.12,19.68 81.12,14.61 | 81.12,14.61 R10.2 | 81.12,14.61 81.12,11.43 82.39,10.16 88.11,10.16 91.28,6.35 98.9,6.35 100.17,7.62 101.44,7.62 110.33,16.51 112.87,16.51 113.5,17.14 116.68,17.14 120.49,20.95 U$1.AVCC
DIR1
  Bottom 0.508: U$2.DIR 48.73,65.41 48.73,64.14 51.91,60.96 67.78,60.96 71.59,57.15 87.47,57.15 91.28,53.34 107.16,53.34 108.63,51.86 U$1.DIR1
DIR2
  Bottom 0.508: U$3.DIR 70.33,65.41 70.33,64.14 73.5,60.96 89.38,60.96 93.19,57.15 109.06,57.15 112.87,53.34 113.5,53.34 114.63,52.21 U$1.DIR2
DIR3
  Bottom 0.508: U$4.DIR 91.92,65.41 91.92,64.14 95.09,60.96 110.97,60.96 114.78,57.15 115.41,57.15 120.63,51.93 U$1.DIR3
DIR4
  Bottom 0.508: U$5.DIR 113.5,65.41 113.5,64.14 116.68,60.96 117.31,60.96 126.63,51.64 U$1.DIR4
DIR5
  Bottom 0.508: U$1.DIR5 132.63,63.58 U$6.DIR
EN1
  Bottom 0.508: R20.1 U$2.EN 32.23,63.5 47.47,63.5 51.27,59.69 67.15,59.69 70.96,55.88 86.83,55.88 90.64,52.07 106,52.07 U$1.EN1
EN2
  Bottom 0.508: R2.1 U$3.EN 53.81,63.5 69.06,63.5 72.87,59.69 88.74,59.69 92.55,55.88 108.42,55.88 112.63,51.67 U$1.EN2
EN3
  Bottom 0.508: R4.1 U$4.EN 75.41,63.5 90.64,63.5 94.45,59.69 110.33,59.69 114.14,55.88 114.78,55.88 118.58,52.07 U$1.EN3 118.63,52.02
EN4
  Bottom 0.508: R6.1 U$5.EN 97,63.5 112.23,63.5 116.05,59.69 116.68,59.69 124.63,51.74 U$1.EN4
EN5
  Bottom 0.508: R8.1 U$6.EN 119.86,62.23 120.49,62.23 130.65,52.07 130.65,51.44 U$1.EN5
GND  (via drill 0.8)
  Top 0.508: v76.17,12.06 79.22,15.88 79.22,29.21 83.03,33.02 88.74,33.02 v90.01,31.75 | v105.89,8.89 105.89,16.51 v104.61,17.78
  Bottom 0.254: 69.82,32.38 69.82,31.75 R21.2 | U$1.GND 105.89,20.95 97,12.06 95.72,12.06 94.45,10.79 EXP2.9 91.92,12.7 91.92,14.61 90.64,15.88 90.64,22.23 93.82,25.4 EXP1.9 | 50.64,46.35 45.56,41.27 44.92,41.27 43.66,42.55 T2.1
  Bottom 0.508: C31.- 34.77,83.82 | R15.2 Q2.S | Q3.S R17.2 | R21.2 Q4.S | T2.1 R42.1 39.21,45.72 39.21,40.64 41.11,38.73 58.26,38.73 59.53,37.47 74.26,37.47 77.94,33.78 77.94,13.34 76.67,12.06 v76.17,12.06 76.17,13.21 75.41,13.97 | 75.53,13.97 75.41,13.97 | 75.41,13.97 75.02,13.97 | 53.18,42.55 53.18,43.81 50.64,46.35 R24.1 T1.1 | XMN.2 XMX.2 YMN.2 YMX.2 ZMN.2 ZMX.2 v105.89,8.89 | EXP1.9 90.64,31.11 v90.01,31.75 | U$1.GND 106.63,19.8 v104.61,17.78 | R13.2 21.18,31.75 | 21.18,31.75 18.27,31.75 | Q1.S 21.18,27.94 21.18,31.75
  Bottom 1.016: U$4.GND@0 76.04,76.83 74.77,75.56 71.59,75.56 69.69,77.47 U$3.GND | U$5.GND@0 97.63,76.83 96.36,75.56 93.19,75.56 91.28,77.47 U$4.GND | U$6.GND@0 119.22,76.83 117.95,75.56 114.78,75.56 112.87,77.47 U$5.GND | U$3.GND@0 54.45,76.83 53.18,75.56 50.01,75.56 48.1,77.47 U$2.GND
  Bottom 1.778: C31.- 32.86,82.04 U$2.GND@0 32.86,76.83 31.59,75.56 30.32,75.56 26.51,71.75 26.51,65.41 25.44,64.33 X1.19 12.28,59.69 12.28,55.45 | 34.77,83.82 36.67,85.72 49.42,85.72 49.42,79.4 U$2.GND | U$3.GND@0 54.45,82.04 C1.- 56.23,85.72 70.96,85.72 70.96,84.51 71.01,84.51 71.01,79.43 U$3.GND | U$4.GND@0 76.04,82.04 C2.- 77.94,83.82 77.94,85.72 92.6,85.72 92.6,79.43 U$4.GND | U$5.GND@0 97.63,82.04 C3.- 99.53,83.82 99.53,85.72 114.19,85.72 114.19,79.43 U$5.GND | U$6.GND@0 119.22,82.04 C4.- 121.12,83.82 121.12,85.72 135.78,85.72 135.78,79.43 U$6.GND | 30.04,24.13 30.04,24.77 32.58,27.3 Q2.S | 30.04,24.13 30.04,16.86 27.78,14.61 25.88,14.61 22.7,17.78 22.7,23.5 21.43,24.77 21.43,27.94 Q1.S | 30.04,24.13 33.21,24.13 35.11,22.23 35.11,17.14 36.39,15.88 38.58,15.88 40.48,17.78 40.48,23.5 41.75,24.77 50.01,24.77 50.01,20.32 X7.2 54.83,19.68 54.83,24.13 | 54.83,24.13 54.83,25.02 Q3.S | 54.83,24.13 58.39,24.13 60.29,22.23 60.29,17.78 62.2,15.88 64.99,15.88 67.28,18.16 67.28,23.5 | 67.28,23.5 67.28,25.4 69.82,27.94 Q4.S | 75.02,13.97 72.48,16.51 72.48,21.59 70.58,23.5 67.28,23.5 | X2.2 12.95,26.64 12.54,27.05
  Bottom 2.54: X1.19 X1.18 12.28,59.69 | X1.17 12.28,59.69 | 7.62,27.05 X8.2 12.54,27.05 12.7,27.05 17.27,30.62 18.27,31.75 18.27,33.02 | 18.27,33.02 18.27,54.69 12.28,59.69 | JP11.1 17.09,32.21 18.27,33.02
  pour Bottom (isolate 0.508, rank 5, no thermals): -0.16,0 140.81,0 140.81,97.16 -0.16,97.16
MOSI1
  Bottom 0.254: EXP1.3 92.55,37.47 92.55,35.56 93.19,34.92 103.34,34.92 105.08,33.19 U$1.MOSI1
N$1
  Bottom 0.508: U$2.MS1 32.86,68.58 JP1.6
N$2
  Bottom 0.508: U$2.MS3 37.94,68.58 JP1.2
N$3
  Bottom 0.508: U$2.MS2 35.4,68.58 JP1.4
N$4
  Bottom 0.508: R19.2 41.75,69.22 39.21,71.75 JP1.1 JP1.3 JP1.5
N$5
  Bottom 0.813: U$2.1B 43.66,78.74 43.66,79.38 46.83,82.55 JP6.4
N$6
  Bottom 0.813: U$2.1A 41.11,78.74 41.11,79.38 41.75,80.01 42.38,80.01 44.29,81.92 JP6.3
N$7
  Bottom 0.813: U$2.2A 38.58,78.74 38.58,79.38 39.84,80.64 40.48,80.64 41.75,81.92 JP6.2
N$8
  Bottom 0.813: U$2.2B 36.03,78.74 36.03,79.38 39.21,82.55 JP6.1
N$9
  Bottom 0.508: U$3.RST U$3.SLP
N$10
  Bottom 0.508: JP3.5 JP3.3 JP3.1 60.8,71.75 63.34,69.22 R1.2
N$11
  Bottom 0.508: U$3.MS1 54.45,68.58 JP3.6
N$12
  Bottom 0.508: U$3.MS3 59.53,68.58 JP3.2
N$13
  Bottom 0.508: U$3.MS2 56.99,68.58 JP3.4
N$14
  Bottom 0.813: U$3.1B 65.25,78.74 65.25,79.38 68.42,82.55 JP2.4
N$15
  Bottom 0.813: U$3.1A 62.7,78.74 62.7,79.38 63.34,80.01 63.98,80.01 65.88,81.92 JP2.3
N$16
  Bottom 0.813: U$3.2A 60.16,78.74 60.16,79.38 61.44,80.64 62.07,80.64 63.34,81.92 JP2.2
N$17
  Bottom 0.813: U$3.2B 57.62,78.74 57.62,79.38 60.8,82.55 JP2.1
N$18
  Bottom 0.508: U$4.RST U$4.SLP
N$19
  Bottom 0.508: R3.2 84.93,69.22 82.39,71.75 JP5.1 JP5.3 JP5.5
N$20
  Bottom 0.508: U$4.MS1 76.04,68.58 JP5.6
N$21
  Bottom 0.508: U$4.MS3 81.12,68.58 JP5.2
N$22
  Bottom 0.508: U$4.MS2 78.58,68.58 JP5.4
N$23
  Bottom 0.813: U$4.1B 86.83,78.74 86.83,79.38 90.01,82.55 JP4.4
N$24
  Bottom 0.813: U$4.1A 84.3,78.74 84.3,79.38 84.93,80.01 85.56,80.01 87.47,81.92 JP4.3
N$25
  Bottom 0.813: U$4.2A 81.75,78.74 81.75,79.38 83.03,80.64 83.66,80.64 84.93,81.92 JP4.2
N$26
  Bottom 0.813: U$4.2B 79.22,78.74 79.22,79.38 82.39,82.55 JP4.1
N$27
  Bottom 0.508: U$5.RST U$5.SLP
N$28
  Bottom 0.508: R5.2 106.52,69.22 103.98,71.75 JP8.1 JP8.3 JP8.5
N$29
  Bottom 0.508: U$5.MS1 97.63,68.58 JP8.6
N$30
  Bottom 0.508: U$5.MS3 102.71,68.58 JP8.2
N$31
  Bottom 0.508: U$5.MS2 100.17,68.58 JP8.4
N$32
  Bottom 0.813: U$5.1B 108.42,78.74 108.42,79.38 111.6,82.55 JP7.4
N$33
  Bottom 0.813: U$5.1A 105.89,78.74 105.89,79.38 106.52,80.01 107.16,80.01 109.06,81.92 JP7.3
N$34
  Bottom 0.813: U$5.2A 103.34,78.74 103.34,79.38 104.61,80.64 105.25,80.64 106.52,81.92 JP7.2
N$35
  Bottom 0.508: U$2.RST U$2.SLP
N$36
  Bottom 0.813: U$5.2B 100.81,78.74 100.81,79.38 103.98,82.55 JP7.1
N$37
  Bottom 0.508: U$6.RST U$6.SLP
N$38
  Bottom 0.508: R7.2 128.11,69.22 125.57,71.75 JP10.1 JP10.3 JP10.5
N$39
  Bottom 0.508: U$6.MS1 119.22,68.58 JP10.6
N$40
  Bottom 0.508: U$6.MS3 124.3,68.58 JP10.2
N$41
  Bottom 0.508: U$6.MS2 121.76,68.58 JP10.4
N$42
  Bottom 0.813: U$6.1B 130.01,78.74 130.01,79.38 133.19,82.55 JP9.4
N$43
  Bottom 0.813: U$6.1A 127.47,78.74 127.47,79.38 128.11,80.01 128.75,80.01 130.65,81.92 JP9.3
N$44
  Bottom 0.813: U$6.2A 124.94,78.74 124.94,79.38 126.2,80.64 126.84,80.64 128.11,81.92 JP9.2
N$45
  Bottom 0.813: U$6.2B 122.39,78.74 122.39,79.38 125.57,82.55 JP9.1
N$46
  Bottom 1.778: Q1.D 23.69,25.68 25.34,24.03 X3.2
N$47
  Bottom 0.508: R16.2 Q2.G
N$48
  Bottom 1.778: Q2.D 35.11,25.4 37.78,22.73 X4.2
N$49
  Bottom 0.508: R18.2 Q3.G
N$50
  Bottom 1.778: Q3.D 60.29,25.4 62.7,22.99 X5.2
N$51
  Bottom 0.508: R22.2 Q4.G
N$58
  Bottom 1.778: Q4.D 72.61,26.42 75.15,23.88 X6.2
N$59
  Bottom 0.508: R14.2 Q1.G
N$60
  Bottom 0.508: T2.3 46.2,43.81 45.56,43.18 JP16.2
N$61
  Bottom 0.508: R42.2 40.48,50.16 41.75,51.44 | 41.75,51.44 44.29,48.9 T2.2 | 41.75,51.44 R37.2
N$62
  Bottom 0.508: T1.3 55.72,43.81 55.09,43.18 JP17.2
N$63
  Bottom 0.508: R24.2 50.01,50.16 R23.2 53.81,48.9 T1.2
P1_22-3RD-SMALL-FET
  Bottom 0.508: R23.1 54.45,52.07 63.34,52.07 67.15,48.26 83.03,48.26 86.83,44.45 100.17,44.45 102.71,41.91 102.71,41.27 104.79,39.19 U$1.P1_22-3RD-SMALL-FET
P1_23-3RD-LARGE-FET
  Bottom 0.508: R37.1 44.29,51.44 46.2,53.34 63.98,53.34 67.78,49.53 83.66,49.53 87.47,45.72 100.81,45.72 103.98,42.55 103.98,41.91 104.7,41.19 U$1.P1_23-3RD-LARGE-FET
P1_30_CLICK-ON-RRD
  Bottom 0.254: EXP1.2 94.45,43.18 92.55,43.18 91.92,42.55 80.48,42.55 78.58,40.64 78.58,36.83 79.85,35.56 79.85,10.16 81.12,8.89 83.03,8.89 87.47,4.45 136.37,4.45 138.27,6.35 138.27,24.77 135.73,27.3 105.89,27.3 U$1.P1_30_CLICK-ON-RRD
P2.6_FAN_FET
  Bottom 0.508: U$1.P2.6_FAN_FET 105.25,46.99 102.71,49.53 89.38,49.53 85.56,53.34 69.69,53.34 65.88,57.15 37.94,57.15 35.4,54.61 35.4,37.12 R15.1 | 33.84,34.29 R15.1 | R15.1 R16.1
P2.7_HOTEND_FET
  Bottom 0.508: R13.1 R14.1 28.41,34.29 34.13,40.01 34.13,55.24 37.3,58.42 66.52,58.42 70.33,54.61 86.2,54.61 90.01,50.8 103.77,50.8 U$1.P2.7_HOTEND_FET
PSUON
  Bottom 0.508: JP11.2 12.7,35.56 15.24,38.1 15.24,49.53 13.04,51.73 X1.16
PWM0_PSU_OUT
  Bottom 0.508: R21.1 R22.1 | U$1.PWM0_PSU_OUT 105.25,43.18 101.44,46.99 88.11,46.99 84.3,50.8 68.42,50.8 64.61,54.61 39.84,54.61 37.94,52.7 37.94,40.01 40.48,37.47 57.62,37.47 58.9,36.2 67.78,36.2 69.69,34.29 R21.1 | 69.82,34.29 R21.1
PWM1_BED_HEATER
  Bottom 0.508: R18.1 R17.1 55.85,36.2 39.84,36.2 36.67,39.37 36.67,53.98 38.58,55.88 65.25,55.88 69.06,52.07 84.93,52.07 88.74,48.26 102.08,48.26 105.25,45.09 U$1.PWM1_BED_HEATER
RX_0
  Bottom 0.508: U$1.RX_0 103.22,23.19 JP18.2
SCK1
  Bottom 0.254: EXP1.5 95.09,37.47 103.34,37.47 105.25,35.56 U$1.SCK1
SD_IRQ-ENC-A-ON-RRD
  Bottom 0.254: EXP2.5 91.92,17.78 91.92,20.95 102.08,31.11 105.25,31.11 U$1.SD_IRQ-ENC-A-ON-RRD
SD_WP-ENC-B-ON-RRD
  Bottom 0.254: EXP2.3 95.09,19.68 97,19.68 99.53,22.23 99.53,26.04 102.71,29.21 104.61,29.21 104.61,29.19 | U$1.SD_WP-ENC-B-ON-RRD 104.61,29.19 | 104.61,29.19 104.6,29.19
SSEL1
  Bottom 0.254: EXP1.4 103.34,38.73 105.25,36.83 U$1.SSEL1
STP1
  Bottom 0.508: U$2.STEP 47.47,67.31 48.73,67.31 50.01,66.04 50.01,64.77 52.55,62.23 68.42,62.23 72.23,58.42 88.11,58.42 91.92,54.61 107.79,54.61 110.63,51.77 U$1.STP1
STP2
  Bottom 0.508: U$3.STEP 69.06,67.31 70.33,67.31 71.59,66.04 71.59,64.77 74.14,62.23 90.01,62.23 93.82,58.42 109.69,58.42 113.5,54.61 114.14,54.61 116.68,52.07 U$1.STP2 116.63,52.12
STP3
  Bottom 0.508: U$4.STEP 90.64,67.31 91.92,67.31 93.19,66.04 93.19,64.77 95.72,62.23 111.6,62.23 115.41,58.42 116.05,58.42 122.63,51.83 U$1.STP3
STP4
  Bottom 0.508: U$5.STEP 112.23,67.31 113.5,67.31 114.78,66.04 114.78,64.77 117.31,62.23 117.95,62.23 128.63,51.55 U$1.STP4
STP5
  Bottom 0.508: U$6.STEP 133.82,67.31 135.09,67.31 136.37,66.04 136.37,64.77 134.63,63.04 U$1.STP5
TH1_HOTEND
  Bottom 0.254: U$1.TH1_HOTEND 119.22,20.95 116.05,17.78 112.87,17.78 112.23,17.14 109.69,17.14 100.81,8.26 99.53,8.26 98.27,6.99 91.92,6.99 C45.1 R10.1 85.56,14.61 84.3,15.88 84.3,31.75 81.12,34.92 JP13.2
TH2_BED
  Bottom 0.254: U$1.TH2_BED 116.05,20.95 116.05,20.32 114.14,18.41 112.23,18.41 111.6,17.78 109.06,17.78 100.17,8.89 98.9,8.89 97.63,7.62 92.55,7.62 90.01,10.16 90.01,12.7 88.74,13.97 88.74,15.88 C44.1 R9.1 84.93,22.23 84.93,33.02 83.66,34.29 JP12.2
TH3
  Bottom 0.254: U$1.TH3 114.63,20.81 112.87,19.05 111.6,19.05 110.97,18.41 108.42,18.41 99.53,9.53 98.27,9.53 97,8.26 93.19,8.26 90.64,10.79 90.64,13.34 89.38,14.61 89.38,20.32 C46.1 R11.1 86.83,24.77 86.2,25.4 JP14.2
TH4
  Bottom 0.254: U$1.TH4 112.23,20.95 110.33,19.05 107.79,19.05 98.9,10.16 97.63,10.16 96.36,8.89 93.82,8.89 91.28,11.43 91.28,13.97 90.01,15.24 90.01,24.77 C47.1 R12.1 87.47,34.29 88.74,35.56 JP15.2
TX_0
  Bottom 0.508: U$1.TX_0 102.33,25.19 JP18.1
X_MAX
  Bottom 0.254: U$1.X_MAX 132.56,20.95 129.38,17.78 126.84,17.78 122.39,13.34 120.49,13.34 119.09,11.94 XMX.3
X_MIN
  Bottom 0.254: U$1.X_MIN 134.46,20.95 130.65,17.14 127.47,17.14 121.76,11.43 XMN.3
Y_MAX
  Bottom 0.254: YMX.3 114.01,12.57 116.05,14.61 121.12,14.61 125.57,19.05 126.84,19.05 128.63,20.84 U$1.Y_MAX
Y_MIN
  Bottom 0.254: YMN.3 116.55,12.57 117.95,13.97 121.76,13.97 126.2,18.41 128.11,18.41 130.63,20.94 U$1.Y_MIN
Z_MAX
  Bottom 0.254: U$1.Z_MAX 124.3,20.95 119.22,15.88 114.78,15.88 114.14,15.24 111.6,15.24 108.93,12.57 ZMX.3
Z_MIN
  Bottom 0.254: U$1.Z_MIN 126.2,20.95 120.49,15.24 115.41,15.24 114.78,14.61 113.5,14.61 111.47,12.57 ZMN.3